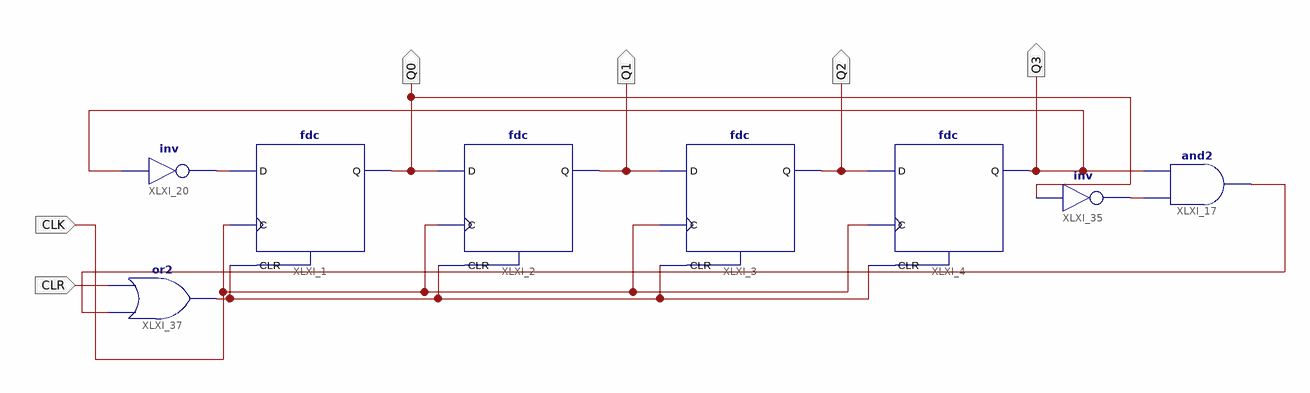
[diagram p0: schematic sheet 1]
// Xilinx ISE schematic p3ej1.sch (spartan3) as structural Verilog: 8 symbols, 6 ports
module p3ej1 (
  input  CLR,
  input  CLK,
  output Q0,
  output Q2,
  output Q3,
  output Q1
);

  wire XLXN_53, XLXN_89, XLXN_93, XLXN_94;

  fdc #(.VeriModel("FDC"), .VhdlModel("FDC")) XLXI_1 (.C(CLK), .CLR(XLXN_89), .D(XLXN_53), .Q(Q0));
  fdc XLXI_2 (.C(CLK), .CLR(XLXN_89), .D(Q0), .Q(Q1));
  fdc XLXI_3 (.C(CLK), .CLR(XLXN_89), .D(Q1), .Q(Q2));
  fdc XLXI_4 (.C(CLK), .CLR(XLXN_89), .D(Q2), .Q(Q3));
  and XLXI_17 (XLXN_93, XLXN_94, Q3);
  not XLXI_20 (XLXN_53, Q3);
  not XLXI_35 (XLXN_94, Q0);
  or XLXI_37 (XLXN_89, XLXN_93, CLR);
endmodule
